# Altium schematic sheet MainBoard_V100_PEAKDET.SchDoc
size A4; SheetNumber: 13; SheetTotal: 22; Title_: Peak Detector
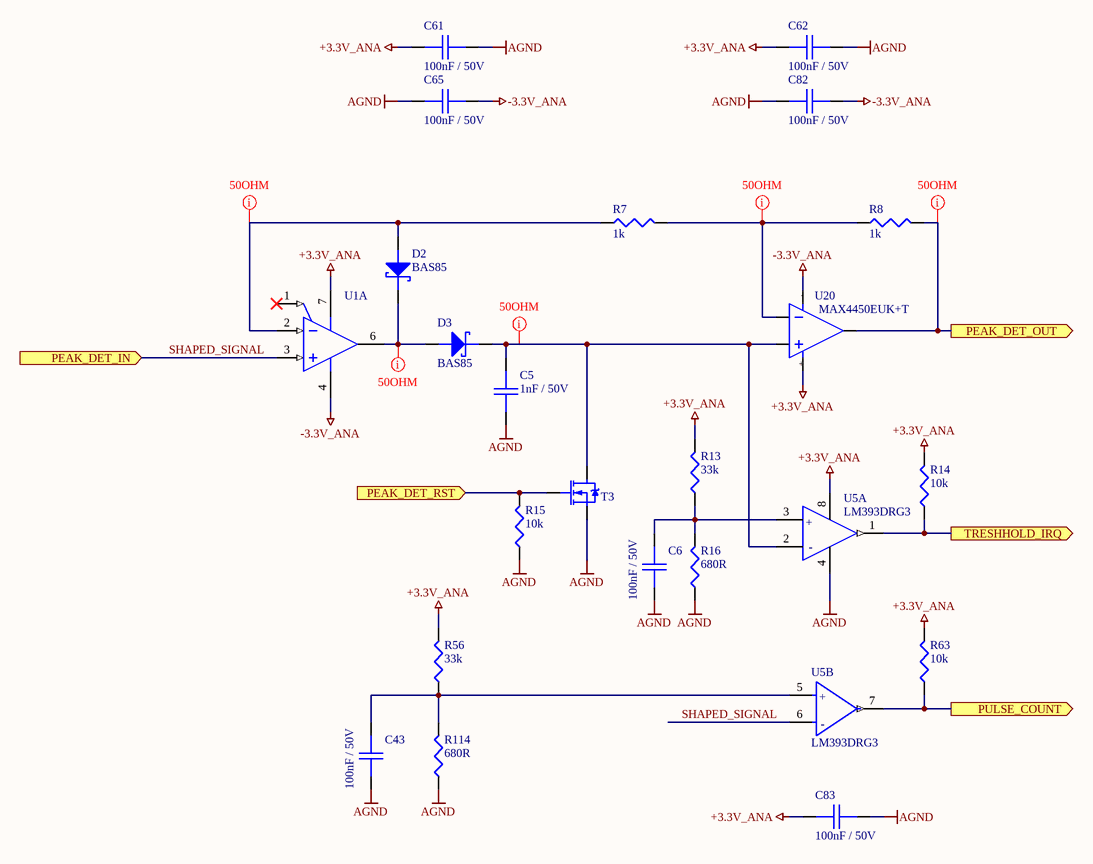
[diagram p0: MainBoard_V100_PEAKDET.SchDoc]

## Parts
C5  1nF / 50V  [0805_C]
C6  100nF / 50V  [0805_C]
C43  100nF / 50V  [0805_C]
C61  100nF / 50V  [0805_C]
C62  100nF / 50V  [0805_C]
C65  100nF / 50V  [0805_C]
C82  100nF / 50V  [0805_C]
C83  100nF / 50V  [0805_C]
D2  BAS85  [SOD80]
D3  BAS85  [SOD80]
R7  1k  [0805]
R8  1k  [0805]
R13  33k  [0805]
R14  10k  [0805]
R15  10k  [0805]
R16  680R  [0805]
R56  33k  [0805]
R63  10k  [0805]
R114  680R  [0805]
T3  2N7002K-7  [SOT-23]  (value not drawn)
U1  LT1806CS8#PBF  [SO-8]  (value not drawn)  (part A of 2)
U5  LM393DRG3  [SO-8]  (parts A,B of 2)
U20  MAX4450EUK+T  [SOT-23-5]

## Ports
PEAK_DET_IN (in), PEAK_DET_OUT (out), PEAK_DET_RST (in), PULSE_COUNT (out), TRESHHOLD_IRQ (out)

## Nets
+3.3V_ANA: C61.1 C62.1 C83.1 R13.2 R14.2 R56.2 R63.2 U1.7(V+) U5.8(Vcc+) U20.5(VCC)
-3.3V_ANA: C65.2 C82.2 U1.4(V-) U20.4(GND)
AGND: C5.2 C6.2 C43.2 C61.2 C62.2 C65.1 C82.1 C83.2 R15.1 R16.1 R114.1 T3.2(S) U5.4(Vcc-)
PEAK_DET_OUT: R8.2 U20.1(OUT) ; port PEAK_DET_OUT
PEAK_DET_RST: R15.2 T3.1(G) ; port PEAK_DET_RST
PULSE_COUNT: R63.1 U5.7(Out2) ; port PULSE_COUNT
SHAPED_SIGNAL: U1.3(+IN) U5.6(In2-) ; port PEAK_DET_IN
TRESHHOLD_IRQ: R14.1 U5.1(Out1) ; port TRESHHOLD_IRQ
NetC5_1: C5.1 D3.K T3.3(D) U5.2(In1-) U20.3(+)
NetC6_1: C6.1 R13.1 R16.2 U5.3(In1+)
NetC43_1: C43.1 R56.1 R114.2 U5.5(In2+)
NetD2_A: D2.A R7.1 U1.2(-IN)
NetD2_K: D2.K D3.A U1.6(OUT)
NetR7_2: R7.2 R8.1 U20.4(-)

Not connected (* = marked no-connect by the designer): U1 1(~{SHDN})*

## Layout directives
net class 50R: NetC5_1, NetD2_A, NetD2_K, NetR7_2, PEAK_DET_OUT

## Notes on the sheet
- Board:
- Author:
- Title:
- Project:
- SVN:
- Version:
- Sheet:
- of
- Contact:
- Modified:
- Size:
- A4
- (in symbol 351, part A) +; -
- (in symbol 351, part B) +; -

## Library data of the parts
C5 = 144: 1nF 50V X7R; Part Number: SMD0805-1nF-50V; Azonosító: 144; Category: Passives; Subcategory: PASS_Capacitor; Supplier 1: HESTORE; Supplier 1 order number: 100.200.70
C6 C43 C61 C62 C65 C82 C83 = 149: 100nF 50V X7R; Part Number: SMD0805-100nF-50V; Azonosító: 149; Category: Passives; Subcategory: PASS_Capacitor; Supplier 1: HESTORE; Supplier 1 order number: 100.011.22
D2 D3 = 371: Small Signal Schottky Diode, Single, 30 V, 200 mA,  125 °C; Azonosító: 371; Part Number: BAS85; Category: Semiconductors; Subcategory: SEMI_Schottky; Supplier 1: HESTORE; Supplier 1 order number: 100.222.42; Supplier 2: FARNELL; Supplier 2 order number: 1097282; Help URL: https://4donline.ihs.com/images/VipMasterIC/IC/NEXP/NEXP-S-A0002881467/NEXP-S-A0002882622-1.pdf?hkey=6D3A4C79FDBF58556ACFDE234799DDF0
R7 R8 = 52: 1k 0805 0.125W 1%; Part Number: SMD0805-1k 1%; Azonosító: 52; Category: Passives; Subcategory: PASS_Resistor; Supplier 1: HESTORE; Supplier 1 order number: 100.312.99
R13 R56 = 62: 33k 0805 0.125W 5%; Part Number: SMD0805-33k 5%; Azonosító: 62; Category: Passives; Subcategory: PASS_Resistor; Supplier 1: HESTORE; Supplier 1 order number: 100.449.27
R14 R15 R63 = 59: 10k 0805 0.125W 1%; Part Number: SMD0805-10k 1%; Azonosító: 59; Category: Passives; Subcategory: PASS_Resistor; Supplier 1: HESTORE; Supplier 1 order number: 100.403.38
R16 R114 = 51: 680R 0805 0.125W 5%; Part Number: SMD0805-680R 5%; Azonosító: 51; Category: Passives; Subcategory: PASS_Resistor; Supplier 1: HESTORE; Supplier 1 order number: 100.011.90
T3 = 315: 2N7002K-7 Power MOSFET, N Channel, 60 V, 300 mA, 2 ohm, SOT-23, Surface Mount; Azonosító: 315; Part Number: 2N7002K-7; Category: Semiconductors; Subcategory: SEMI_FET; Supplier 1: HESTORE; Supplier 1 order number: 100.411.92; Supplier 2: MOUSER; Supplier 2 order number: 621-2N7002K-7; Help URL: https://hu.mouser.com/datasheet/2/115/DIOD_S_A0012992590_1-2543827.pdf
U1 = 353: Single Channel, High Speed, Low Noise Precision Operational Amplifier, 325 MHz Typical GBW, 125 V/us Typical SR, 2.5 to 12.6 V, 8-Pin SOIC; Manufacturer: Linear Technology; Linear Technology Part Number: LT1806; Is (mA) Typical: 9; GBW (MHz) Typical: 325; SR (V/us) Typical: 125; Vos (mV) Guaranteed: 0.55; Vos (mV) Typical: 0.1; Vs Max (V): 12.6; Vs Min (V): 2.5; Channels (#): 1; Azonosító: 353; DatasheetVersion: Rev. C; ComponentLink3Description: Package Specification; Mounting Technology: Surface Mount; ComponentLink2Description: Datasheet; RevisionNote: URLs updated; PackageDescription: 8-Pin Plastic Small Outline, Body 4.9 x 3.9 mm, Pitch 1.27 mm; PackageVersion: Rev G; RoHS: Pb-Free; Type: VFB; PackageReference: LT-S8-8; ComponentLink2URL: http://cds.linear.com/docs/en/datasheet/18067fc.pdf; ComponentLink3URL: http://cds.linear.com/docs/en/packaging/05081610_G_SO8.pdf; PartNumber: LT1806CS8#PBF; ComponentLink1Description: Manufacturer URL; ComponentLink1URL: http://www.linear.com/; Part Number: LT1806CS8#PBF; Category: Integrated Circuits; Subcategory: IC_Analog; Supplier 1: MOUSER; Supplier 1 order number: 584-LT1806CS8#PBF; Help URL: https://hu.mouser.com/datasheet/2/609/18067fc-3124195.pdf
U5 = 351: IC VOLT COMPARATOR DUAL LP 8SOIC; Manufacturer Part Number: LM393D; Manufacturer: STMicroelectronics; Response Time: 1.3us; Min Supply Voltage: 2V; Input Offset Voltage: 1mV; Input Bias Current: 0.02uA; Max Dual Supply Voltage: 18V; Output Current Per Channel: 18mA; Max Junction Temp: +150°C; Standoff Height: 0.1mm; Number Of Channels: 2; Nominal Supply Current: 0.45-0.6mA; Voltage Gain: 200V/mV; Max Supply Voltage: 36V; Min Dual Supply Voltage: 1V; Azonosító: 351; Ambient Temperature Range Low: 0°C; ComponentLink2Description: Datasheet; Lead Free: Yes; Device Class L3: Comparators; Device Class L2: Linear ICs; Digikey Description: IC VOLT COMPARATOR DUAL LP 8SOIC; Category: Integrated Circuits; Octopart: https://octopart.com/lm393d-stmicroelectronics-25832; Package: SO8; RoHS: TRUE; Footprint Url: https://www.st.com/resource/en/datasheet/stm8l001j3.pdf; Temperature Range Low: 0°C; Temperature Range High: +70°C; Mouser Description: Analog Comparators Lo-Pwr Dual Voltage; ComponentLink2URL: https://www.st.com/resource/en/datasheet/lm393.pdf; Automotive: No; Temperature: 0°C to +70°C; Height: 1.75mm; Device Class L1: Integrated Circuits (ICs); Ambient Temperature Range High: +70°C; Part Number: LM393DRG3; Subcategory: IC_Analog; Supplier 1: MOUSER; Supplier 1 order number: 595-LM393DRG3; Help URL: https://www.ti.com/general/docs/suppproductinfo.tsp?distId=26&gotoUrl=https://www.ti.com/lit/gpn/lm393
U20 = 193: Operational Amplifier, Rail to Rail Output, SOT-23-5, 210 MHz, 485 V/µs; Azonosító: 193; Part Number: MAX4450EUK+T; Category: Integrated Circuits; Subcategory: ICs__Analog; Supplier 1: MOUSER; Supplier 1 order number: 700-MAX4450EUKT; Supplier 2: FARNELL; Supplier 2 order number: 2511061; Help URL: https://hu.mouser.com/datasheet/2/609/MAX4450_MAX4451-3129836.pdf